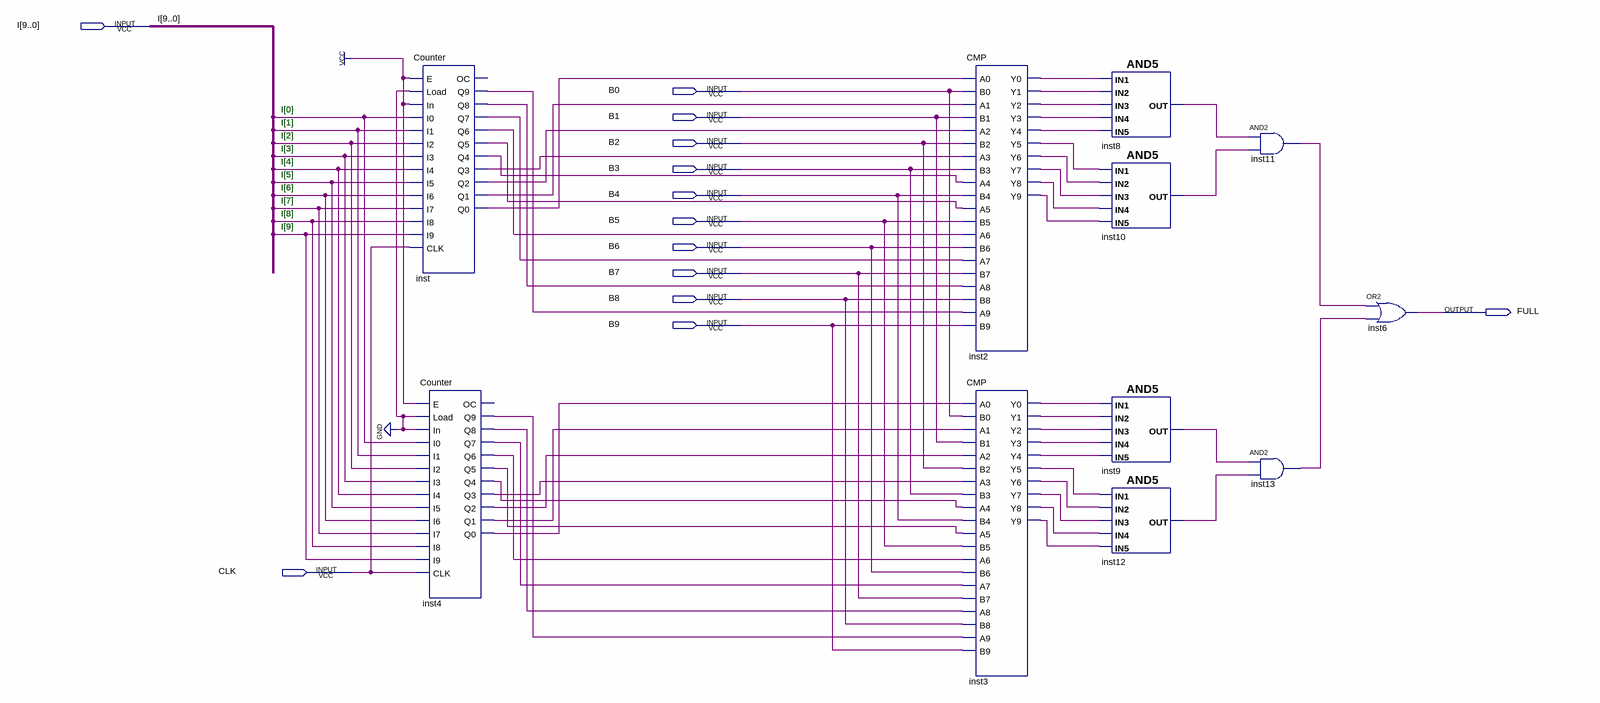
[diagram p0: schematic sheet]
// Quartus schematic CGL.bdf as structural Verilog: 11 symbols, 13 pins
module CGL (
  input  [9:0] I,
  input  B0,
  input  B1,
  input  B2,
  input  B3,
  input  B4,
  input  B5,
  input  B6,
  input  B7,
  input  B8,
  input  B9,
  input  CLK,
  output FULL
);

  wire inst2_y0, inst2_y1, inst2_y2, inst2_y3, inst2_y4, inst2_y5, inst2_y6, inst2_y7, inst2_y8, inst2_y9,
       inst3_y0, inst3_y1, inst3_y2, inst3_y3, inst3_y4, inst3_y5, inst3_y6, inst3_y7, inst3_y8, inst3_y9,
       inst4_q0, inst4_q1, inst4_q2, inst4_q3, inst4_q4, inst4_q5, inst4_q6, inst4_q7, inst4_q8, inst4_q9,
       inst8_out, inst9_out, inst10_out, inst11_out, inst12_out, inst13_out, inst_q0, inst_q1, inst_q2,
       inst_q3, inst_q4, inst_q5, inst_q6, inst_q7, inst_q8, inst_q9;

  Counter inst (
    .E(1'b1), .Load(1'b0), .In(1'b1), .I0(I[0]), .I1(I[1]), .I2(I[2]), .I3(I[3]), .I4(I[4]), .I5(I[5]),
    .I6(I[6]), .I7(I[7]), .I8(I[8]), .I9(I[9]), .CLK(CLK), .Q9(inst_q9), .Q8(inst_q8), .Q7(inst_q7),
    .Q6(inst_q6), .Q5(inst_q5), .Q4(inst_q4), .Q3(inst_q3), .Q2(inst_q2), .Q1(inst_q1), .Q0(inst_q0));  // open: OC
  Counter inst4 (
    .E(1'b1), .Load(1'b0), .In(1'b0), .I0(I[0]), .I1(I[1]), .I2(I[2]), .I3(I[3]), .I4(I[4]), .I5(I[5]),
    .I6(I[6]), .I7(I[7]), .I8(I[8]), .I9(I[9]), .CLK(CLK), .Q9(inst4_q9), .Q8(inst4_q8), .Q7(inst4_q7),
    .Q6(inst4_q6), .Q5(inst4_q5), .Q4(inst4_q4), .Q3(inst4_q3), .Q2(inst4_q2), .Q1(inst4_q1), .Q0(inst4_q0));  // open: OC
  CMP inst2 (
    .A0(inst_q0), .B0(B0), .A1(inst_q1), .B1(B1), .A2(inst_q2), .B2(B2), .A3(inst_q3), .B3(B3), .A4(inst_q4),
    .B4(B4), .A5(inst_q5), .B5(B5), .A6(inst_q6), .B6(B6), .A7(inst_q7), .B7(B7), .A8(inst_q8), .B8(B8),
    .A9(inst_q9), .B9(B9), .Y0(inst2_y0), .Y1(inst2_y1), .Y2(inst2_y2), .Y3(inst2_y3), .Y4(inst2_y4),
    .Y5(inst2_y5), .Y6(inst2_y6), .Y7(inst2_y7), .Y8(inst2_y8), .Y9(inst2_y9));
  CMP inst3 (
    .A0(inst4_q0), .B0(B0), .A1(inst4_q1), .B1(B1), .A2(inst4_q2), .B2(B2), .A3(inst4_q3), .B3(B3),
    .A4(inst4_q4), .B4(B4), .A5(inst4_q5), .B5(B5), .A6(inst4_q6), .B6(B6), .A7(inst4_q7), .B7(B7),
    .A8(inst4_q8), .B8(B8), .A9(inst4_q9), .B9(B9), .Y0(inst3_y0), .Y1(inst3_y1), .Y2(inst3_y2),
    .Y3(inst3_y3), .Y4(inst3_y4), .Y5(inst3_y5), .Y6(inst3_y6), .Y7(inst3_y7), .Y8(inst3_y8), .Y9(inst3_y9));
  and inst8 (inst8_out, inst2_y0, inst2_y1, inst2_y2, inst2_y3, inst2_y4);
  and inst10 (inst10_out, inst2_y5, inst2_y6, inst2_y7, inst2_y8, inst2_y9);
  and inst9 (inst9_out, inst3_y0, inst3_y1, inst3_y2, inst3_y3, inst3_y4);
  and inst12 (inst12_out, inst3_y5, inst3_y6, inst3_y7, inst3_y8, inst3_y9);
  and inst11 (inst11_out, inst8_out, inst10_out);
  and inst13 (inst13_out, inst9_out, inst12_out);
  or inst6 (FULL, inst11_out, inst13_out);

  // Notes on the sheet:
  //   I[0]
  //   I[1]
  //   I[2]
  //   I[3]
  //   I[4]
  //   I[5]
  //   I[6]
  //   I[7]
  //   I[8]
  //   I[9]
endmodule
